# Altium project NoFollowBoard.PrjPcb
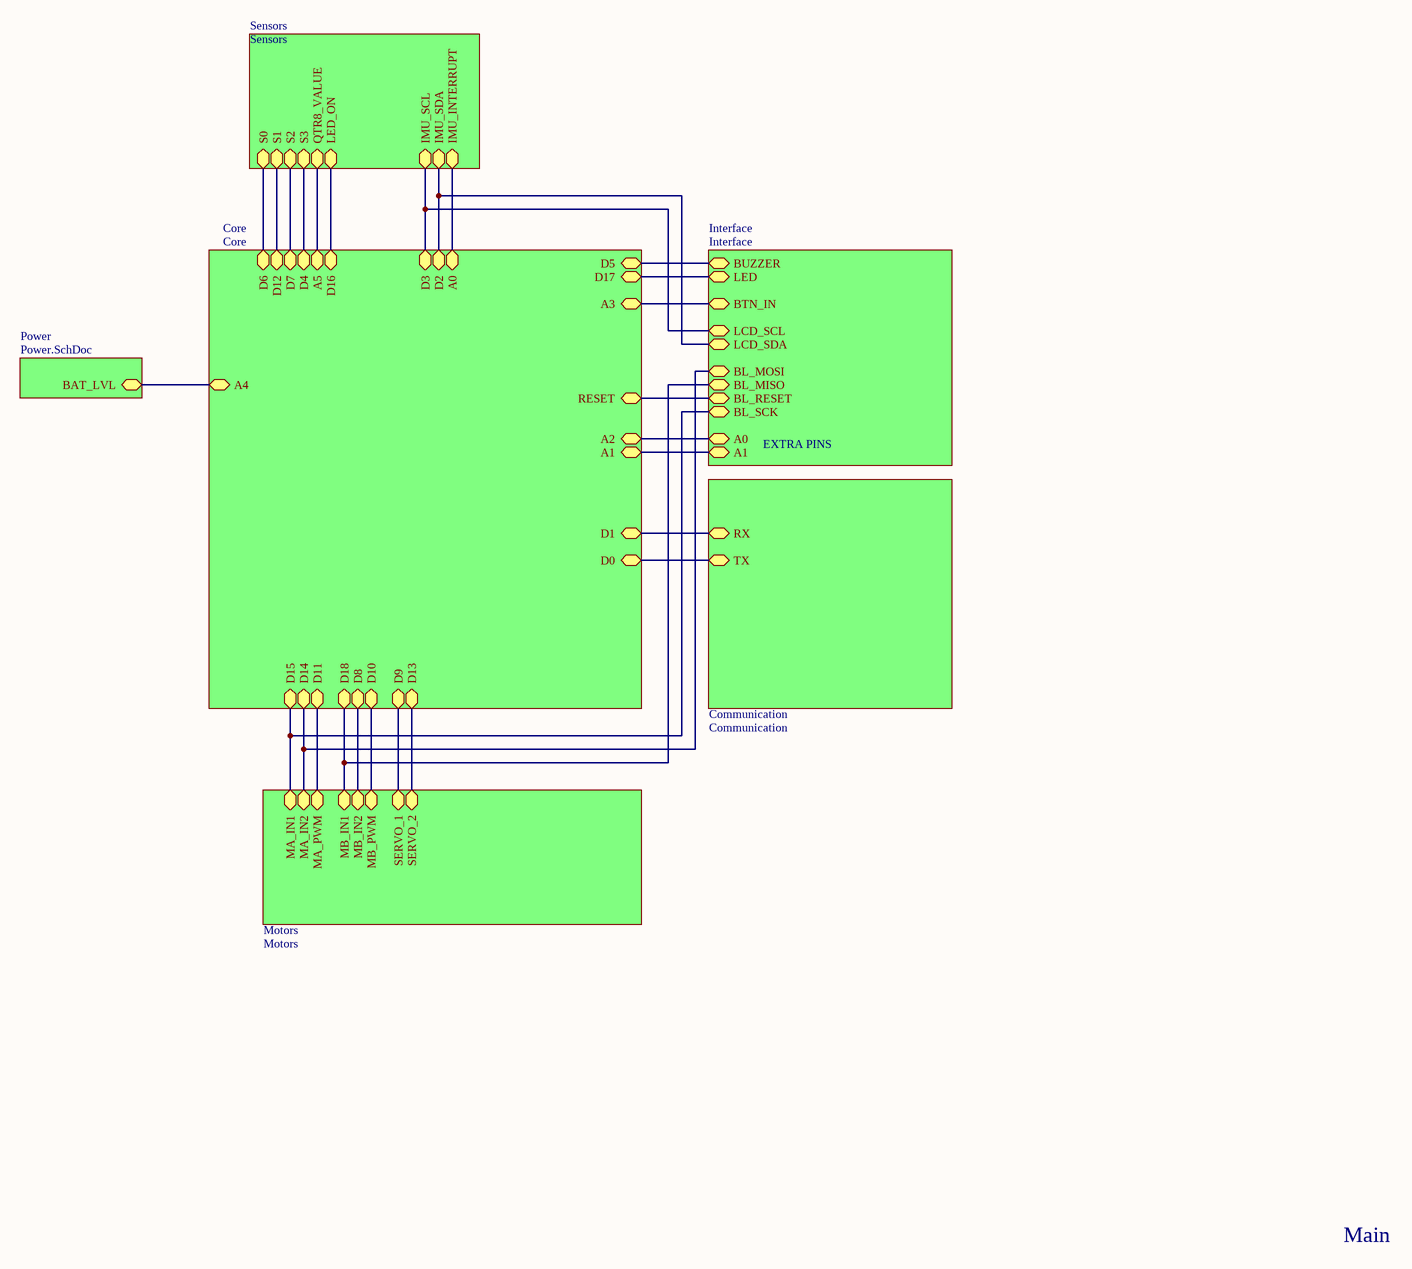
[diagram p0: Main.SchDoc]
4 sheets, 35 parts. Net scope: hierarchical (ports join the sheet entries above them; power ports are global).
Sheets:
  Main.SchDoc
    Sensors = Sensors.SchDoc
    Motors = Motors.SchDoc
    Power = Power.SchDoc

## Sheet Main.SchDoc
size A3

### Sub-sheets
Communication = Communication (file not in this document): RX (bidir), TX (bidir)
Core = Core (file not in this document): D6 (bidir), D12 (bidir), D7 (bidir), D4 (bidir), A5 (bidir), D3 (bidir), D2 (bidir), A0 (bidir), D5 (bidir), D17 (bidir), A3 (bidir), D1 (bidir), D0 (bidir), D8 (bidir), D18 (bidir), D11 (bidir), D14 (bidir), D15 (bidir), D10 (bidir), D9 (bidir), D16, A4, A2, A1, D13, RESET
Interface = Interface (file not in this document): BUZZER (bidir), LED (bidir), BTN_IN (bidir), LCD_SCL (bidir), LCD_SDA (bidir), A0, A1, BL_MOSI, BL_MISO, BL_RESET, BL_SCK
Motors = Motors: MA_IN1 (bidir), MA_IN2 (bidir), MA_PWM (bidir), MB_IN1 (bidir), MB_IN2 (bidir), MB_PWM (bidir), SERVO_1 (bidir), SERVO_2
Power = Power.SchDoc: BAT_LVL
Sensors = Sensors: S0 (bidir), S1 (bidir), S2 (bidir), S3 (bidir), QTR8_VALUE (bidir), IMU_SCL (bidir), IMU_SDA (bidir), IMU_INTERRUPT (bidir), LED_ON

### Nets
NetGY1_3: sheet Core/D3, sheet Sensors/IMU_SCL, sheet Interface/LCD_SCL
NetGY1_4: sheet Core/D2, sheet Sensors/IMU_SDA, sheet Interface/LCD_SDA
NetGY1_8: sheet Core/A0, sheet Sensors/IMU_INTERRUPT
NetJ4_3: sheet Core/D9, sheet Motors/SERVO_1
NetJ5_3: sheet Core/D13, sheet Motors/SERVO_2
NetJ6_9: sheet Core/D16, sheet Sensors/LED_ON
NetMUX1_1: sheet Core/A5, sheet Sensors/QTR8_VALUE
NetMUX1_10: sheet Core/D6, sheet Sensors/S0
NetMUX1_11: sheet Core/D12, sheet Sensors/S1
NetMUX1_13: sheet Core/D4, sheet Sensors/S3
NetMUX1_14: sheet Core/D7, sheet Sensors/S2
NetR11_2: sheet Core/D15, sheet Interface/BL_SCK, sheet Motors/MA_IN1
NetR12_2: sheet Core/D18, sheet Interface/BL_MISO, sheet Motors/MB_IN1
NetR13_2: sheet Core/D8, sheet Motors/MB_IN2
NetR14_2: sheet Core/D14, sheet Interface/BL_MOSI, sheet Motors/MA_IN2
NetR15_1: sheet Core/A4, sheet Power/BAT_LVL
NetU2_8: sheet Core/D11, sheet Motors/MA_PWM
NetU2_14: sheet Core/D10, sheet Motors/MB_PWM
(unnamed): sheet Core/D5, sheet Interface/BUZZER
(unnamed): sheet Core/D17, sheet Interface/LED
(unnamed): sheet Core/A3, sheet Interface/BTN_IN
(unnamed): sheet Core/D1, sheet Communication/RX
(unnamed): sheet Core/D0, sheet Communication/TX
(unnamed): sheet Core/A2, sheet Interface/A0
(unnamed): sheet Core/A1, sheet Interface/A1
(unnamed): sheet Core/RESET, sheet Interface/BL_RESET

### Notes on the sheet
- EXTRA PINS
- Main

## Sheet Sensors.SchDoc
size A3; PageSetup: Record=PageOptions|CenterHorizontal=True|CenterVertical=True|PrintScale=1.00|XCorrection=1.00|YCorrection=1.00|PrintKind=1|BorderSize=5000000|LeftOffset=0|BottomOffset=0|Orientation=2|PaperLength=1000|PaperWidth=1000|Scale=100|PaperSource=7|PrintQuality=-3|MediaType=1|DitherType=10|PrintScaleMode=1|PaperKind=A2|PaperIndex=66
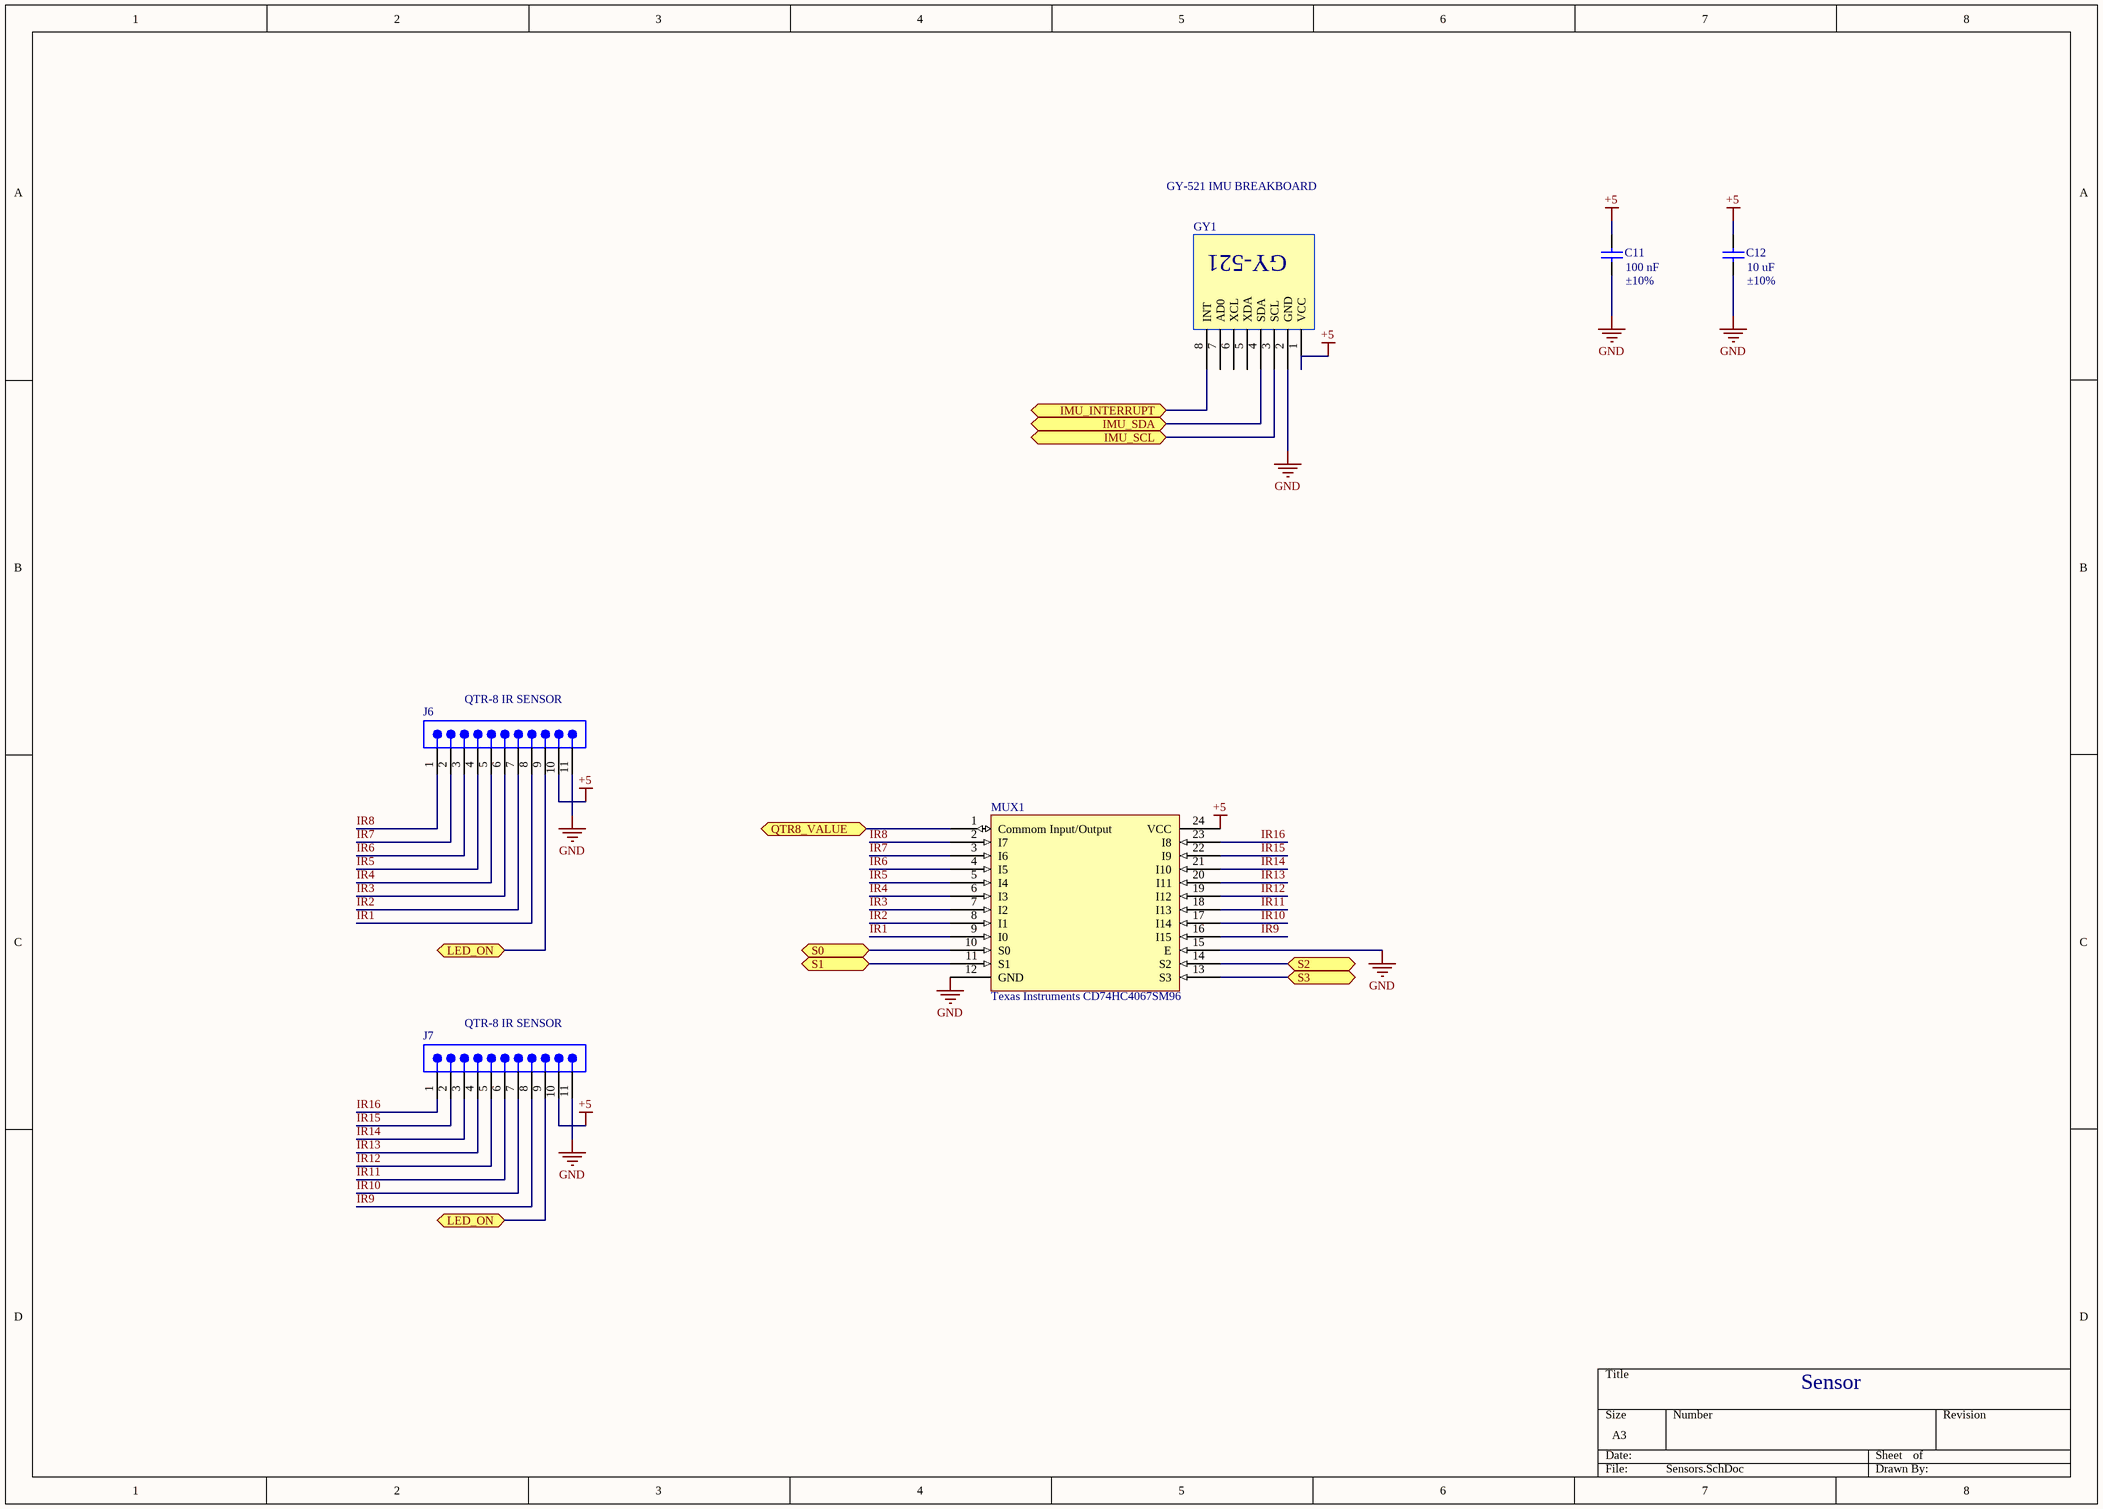
[diagram p1: Sensors.SchDoc]

### Parts
C11  Capacitance: 100 nF  Capacitance Tolerance: ±10%  [PCB-i747o4qnz4fc2aqkwc14-1]  (hidden comment: Taiyo Yuden LMK212BJ106KG-T)
C12  Capacitance: 10 uF  Capacitance Tolerance: ±10%  [PCB-i747o4qnz4fc2aqkwc14-1]  (hidden comment: Taiyo Yuden LMK212BJ106KG-T)
GY1  GY-521 MPU-6050 IMU  [PCBComponent_1]  (value not drawn)
J6  Samtec TSW-111-05-G-S  [1X11]  (value not drawn)
J7  Samtec TSW-111-05-G-S  [1X11]  (value not drawn)
MUX1  Texas Instruments CD74HC4067SM96  [PCBComponent_1]

### Ports
IMU_INTERRUPT (bidir), IMU_SCL (bidir), IMU_SDA (bidir), LED_ON (bidir), QTR8_VALUE (bidir), S0 (bidir), S1 (bidir), S2 (bidir), S3 (bidir)

### Nets
+5: C11.2 C12.2 GY1.1(VCC) J6.10 J7.10 MUX1.24(VCC)
GND: C11.1 C12.1 GY1.2(GND) J6.11 J7.11 MUX1.12(GND) MUX1.15(E)
IR1: J6.8 MUX1.9(I0)
IR2: J6.7 MUX1.8(I1)
IR3: J6.6 MUX1.7(I2)
IR4: J6.5 MUX1.6(I3)
IR5: J6.4 MUX1.5(I4)
IR6: J6.3 MUX1.4(I5)
IR7: J6.2 MUX1.3(I6)
IR8: J6.1 MUX1.2(I7)
IR9: J7.8 MUX1.16(I15)
IR10: J7.7 MUX1.17(I14)
IR11: J7.6 MUX1.18(I13)
IR12: J7.5 MUX1.19(I12)
IR13: J7.4 MUX1.20(I11)
IR14: J7.3 MUX1.21(I10)
IR15: J7.2 MUX1.22(I9)
IR16: J7.1 MUX1.23(I8)
NetGY1_3: GY1.3(SCL) ; port IMU_SCL
NetGY1_4: GY1.4(SDA) ; port IMU_SDA
NetGY1_8: GY1.8(INT) ; port IMU_INTERRUPT
NetJ6_9: J6.9 J7.9 ; port LED_ON
NetMUX1_1: MUX1.1(Commom_Input/Output) ; port QTR8_VALUE
NetMUX1_10: MUX1.10(S0) ; port S0
NetMUX1_11: MUX1.11(S1) ; port S1
NetMUX1_13: MUX1.13(S3) ; port S3
NetMUX1_14: MUX1.14(S2) ; port S2

Not connected (* = marked no-connect by the designer): GY1 5(XDA) 6(XCL) 7(AD0)

### Notes on the sheet
- GY-521 IMU BREAKBOARD
- (near J6) QTR-8 IR SENSOR
- (near J7) QTR-8 IR SENSOR
- Sensor
- (in symbol CMP-1172158-5) GY-521

### Library data of the parts
C11 C12 = CMP-6ecba7c24c09b10c-2: Cap Ceramic 10uF 10V X5R 10% SMD 0805 85?C T/R; Lead-Free Status: Lead Free; Voltage Rating (DC): 10.0 V; Case/Package (SI): 2012; Mounting Style: Surface Mount; Manufacturer Part Number: LMK212BJ106KG-T; Packaging: Cut Tape (CT); RoHS: Compliant; Number of Pins: 2; Lifecycle Status: Not Listed by Manufacturer; OctopartID: 6ecba7c24c09b10c; Size-Length: 0.002 m; Size-Height: 0.00125 m; Dielectric Characteristic: X5R; Octopart URL: http://octopart.com/lmk212bj106kg-t-taiyo+yuden-198564; Size-Width: 0.00125 m; Case/Package: 0805
GY1 = CMP-1172158-5: 3-axis gyroscope, 3-axis accelerometer breakout board; Supply Voltage (DC): 5v; Packaging: Cut Tape (CT); REACH SVHC Compliance: No SVHC; Number of Pins: 8; Octopart URL: http://octopart.com/mpu-6050-invensense-19505926; OctopartID: 29a8e18bafc8f66f; RoHS: Compliant; Manufacturer Part Number: MPU-6050
J6 J7 = CMP-3970764-2: CONN HEADER 11POS .100" SGL GOLD; Gender: Male; Lead-Free Status: Lead Free; Number of Contacts: 11; Pin Pitch: 0.00254 m; Contact Material: Phosphor Bronze; Contact Plating: Gold; Housing Color: Black; Housing Material: Plastic; Mounting Style: Through Hole; Number of Positions: 11; Number of Rows: 1; Octopart Url: https://octopart.com/tsw-111-05-g-s-samtec-271406; OctopartID: 84944d9a85dc5b53; REACH SVHC Compliance: No SVHC; RoHS: Compliant; Size-Height: 0.00254 m; Size-Length: 0.02794 m; Size-Width: 0.00254 m
MUX1 = CMP-106ed96303d9cfa9-2: High Speed CMOS 16-Channel Analog Multiplexer/Demultiplexer 24-SSOP -55 to 125; Supply Voltage (DC): 2.00 V (min); Number of Bits: 16; Lead-Free Status: Lead Free; Number of Circuits: 1; Polarity: Non-Inverting; Mounting Style: Surface Mount; OctopartID: 106ed96303d9cfa9; Case/Package: SSOP; Number of Outputs: 16; Number of Channels: 16; RoHS: Compliant; Number of Pins: 24; Lifecycle Status: Active; REACH SVHC Compliance: No SVHC; Packaging: Tape & Reel (TR), Cut Tape (CT); Octopart URL: http://octopart.com/cd74hc4067sm96-texas+instruments-472785; Manufacturer Part Number: CD74HC4067SM96

## Sheet Motors.SchDoc
size A
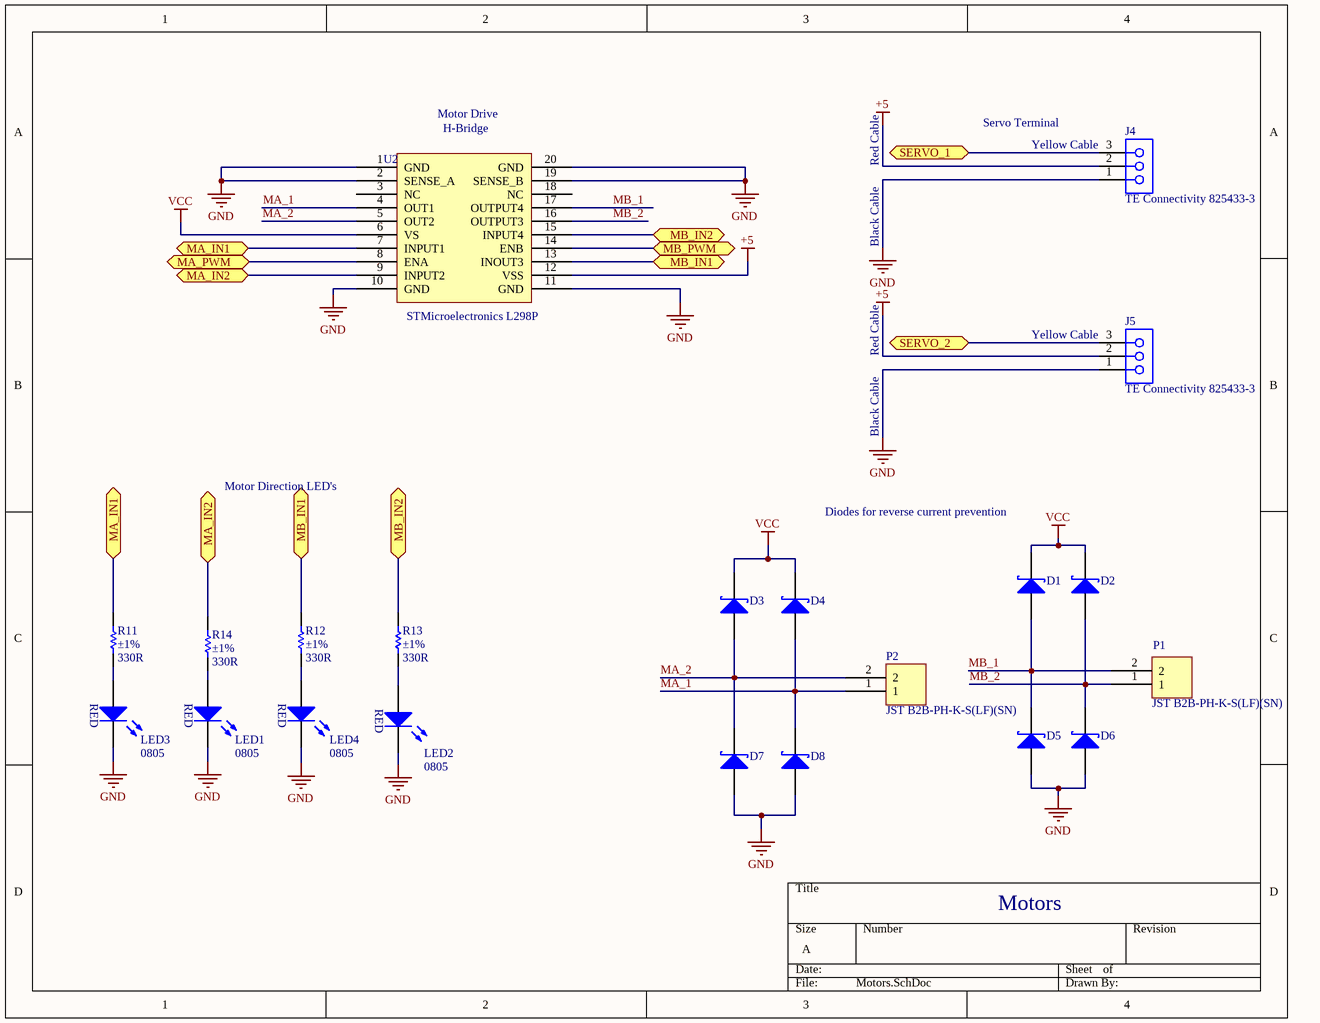
[diagram p2: Motors.SchDoc]

### Parts
D1  SS34 SMA DO-214AC  [SMA]  (value not drawn)
D2  SS34 SMA DO-214AC  [SMA]  (value not drawn)
D3  SS34 SMA DO-214AC  [SMA]  (value not drawn)
D4  SS34 SMA DO-214AC  [SMA]  (value not drawn)
D5  SS34 SMA DO-214AC  [SMA]  (value not drawn)
D6  SS34 SMA DO-214AC  [SMA]  (value not drawn)
D7  SS34 SMA DO-214AC  [SMA]  (value not drawn)
D8  SS34 SMA DO-214AC  [SMA]  (value not drawn)
J4  TE Connectivity 825433-3  [PCB-43x6b8o6d5mxbq35c0sh-1]
J5  TE Connectivity 825433-3  [PCB-43x6b8o6d5mxbq35c0sh-1]
LED1  Case/Package: 0805  [LED0805]  (hidden comment: CMP-7f15b6173d91a0d2-5)
LED2  Case/Package: 0805  [LED0805]  (hidden comment: CMP-7f15b6173d91a0d2-5)
LED3  Case/Package: 0805  [LED0805]  (hidden comment: CMP-7f15b6173d91a0d2-5)
LED4  Case/Package: 0805  [LED0805]  (hidden comment: CMP-7f15b6173d91a0d2-5)
P1  JST B2B-PH-K-S(LF)(SN)  [PCB-gpdi66yn1jko56crxrq7-1]
P2  JST B2B-PH-K-S(LF)(SN)  [PCB-gpdi66yn1jko56crxrq7-1]
R11  Resistance Tolerance: ±1%  Resistance: 330R  [PCB-4097432-1]  (hidden comment: Bourns CR0805-FX-4701GLF)
R12  Resistance Tolerance: ±1%  Resistance: 330R  [PCB-4097432-1]  (hidden comment: Bourns CR0805-FX-4701GLF)
R13  Resistance Tolerance: ±1%  Resistance: 330R  [PCB-4097432-1]  (hidden comment: Bourns CR0805-FX-4701GLF)
R14  Resistance Tolerance: ±1%  Resistance: 330R  [PCB-4097432-1]  (hidden comment: Bourns CR0805-FX-4701GLF)
U2  STMicroelectronics L298P  [L298PSOIC127P1420X360-20N]

### Ports
MA_IN1 (bidir), MA_IN2 (bidir), MA_PWM (bidir), MB_IN1 (bidir), MB_IN2 (bidir), MB_PWM (bidir), SERVO_1 (bidir), SERVO_2 (bidir)

### Nets
+5: J4.2 J5.2 U2.12(VSS)
GND: D5.1(A) D6.1(A) D7.1(A) D8.1(A) J4.1 J5.1 LED1.1(K) LED2.1(K) LED3.1(K) LED4.1(K) U2.1(GND) U2.2(SENSE_A) U2.10(GND) U2.11(GND) U2.19(SENSE_B) U2.20(GND)
VCC: D1.2(K) D2.2(K) D3.2(K) D4.2(K) U2.6(VS)
MA_1: D4.1(A) D8.2(K) P2.1 U2.4(OUT1)
MA_2: D3.1(A) D7.2(K) P2.2 U2.5(OUT2)
MB_1: D1.1(A) D5.2(K) P1.2 U2.17(OUTPUT4)
MB_2: D2.1(A) D6.2(K) P1.1 U2.16(OUTPUT3)
NetJ4_3: J4.3 ; port SERVO_1
NetJ5_3: J5.3 ; port SERVO_2
NetLED1_2: LED1.2(A) R14.1
NetLED2_2: LED2.2(A) R13.1
NetLED3_2: LED3.2(A) R11.1
NetLED4_2: LED4.2(A) R12.1
NetR11_2: R11.2 U2.7(INPUT1) ; port MA_IN1
NetR12_2: R12.2 U2.13(INOUT3) ; port MB_IN1
NetR13_2: R13.2 U2.15(INPUT4) ; port MB_IN2
NetR14_2: R14.2 U2.9(INPUT2) ; port MA_IN2
NetU2_8: U2.8(ENA) ; port MA_PWM
NetU2_14: U2.14(ENB) ; port MB_PWM

Not connected (* = marked no-connect by the designer): U2 3(NC) 18(NC)

### Notes on the sheet
- (near U2) Motor Drive
- (near U2) H-Bridge
- Red Cable
- Servo Terminal
- (near J4) Yellow Cable
- Black Cable
- (near J5) Yellow Cable
- Motor Direction LED's
- Diodes for reverse current prevention
- Motors
- (in symbol CMP-7f15b6173d91a0d2-5) RED

### Library data of the parts
D1-D8 = CMP-cx3sevj7k2ks0umzedmk-1: A Schotty Barrier Rectifier; CustomComponentID: cx3sevj7k2ks0umzedmk
J4 J5 = CMP-52d299a8d8748d15-5: Pin header; pin strips; AMPMODU MOD II; male; PIN: 3; straight; ELV Compliant: Compliant; Pin Pitch: 0.00254 m; Number of Contacts: 3; Current Rating: 3.0 A; Housing Color: Green; OctopartID: 52d299a8d8748d15; REACH SVHC Compliance: No SVHC; Flammability Rating: UL 94 V-0; Orientation: Vertical; Lifecycle Status: Active; Octopart URL: http://octopart.com/825433-3-te+connectivity-40939456; Housing Material: Polyester; Packaging: Box; Contact Plating: Gold, Gold over Nickel, Tin, Tin over Nickel; Gender: Male; Manufacturer Part Number: 825433-3; Mounting Style: PCB; Contact Material: Brass; RoHS: Compliant
LED1-LED4 = CMP-7f15b6173d91a0d2-5: LED; SMD; 0805; red; 7.2-17mcd; 2x1.25mm; 170°; 1.8÷2.6V; 20mA; Manufacturer Part Number: HSMH-C170; Lead-Free Status: Lead Free; Lens Type: Diffused; Power Dissipation: 0.065 W; Voltage Rating (DC): 1.8 V; Luminous Intensity: 0.017 cd; Lens Color: Clear; Peak Wavelength: 6.6e-07 m; Wavelength: 6.39e-07 m; Case/Package (SI): 2012; RoHS: Compliant; Number of Pins: 2; Forward Voltage: 1.8 V; Packaging: Cut Tape (CT); Viewing Angle: 170 °; Octopart URL: http://octopart.com/hsmh-c170-avago-550882; REACH SVHC Compliance: No SVHC; Order Code (RS Components): 486-0468; Color: Red; OctopartID: 7f15b6173d91a0d2; Lifecycle Status: Active; Mounting Style: Surface Mount, Vertical; Part Description: *
P1 P2 = CMP-642947-5: PH Series 2 Position 2 mm Pitch Through Hole Top Entry Shrouded Header; Number of Positions: 2; Pin Pitch: 2.00 mm; Current Rating: 2.00 A; Insulation Resistance: 1.00 MΩ; Gender: Male; Lead-Free Status: Lead Free; Voltage Rating (AC): 100 V; Contact Resistance: 10.0 mΩ; Packaging: Bulk; RoHS: Compliant; REACH SVHC Compliance: No SVHC; Size-Length: 5.90 mm; OctopartID: a21c6b154b5e7ddb; Octopart URL: http://octopart.com/b2b-ph-k-s%28lf%29%28sn%29-jst-248868; Size-Height: 6.00 mm; Housing Material: Nylon; Size-Width: 4.50 mm; Mounting Style: Through Hole, Vertical; Manufacturer Part Number: B2B-PH-K-S(LF)(SN); Number of Rows: 1; Contact Material: Brass; Housing Color: Natural; Number of Contacts: 2; Contact Plating: Tin
R11-R14 = CMP-97505e06006c4897-1: Res Thick Film 0805 4.7K Ohm 1% 1/8W ±100ppm/°C Molded SMD SMD Paper Tape on Plastic Reel; Voltage Rating (DC): 150 V; Power Rating: 125 mW; Manufacturer Part Number: CR0805-FX-4701GLF; REACH SVHC Compliance: No SVHC; OctopartID: 97505e06006c4897; Packaging: Tape & Reel (TR), Cut Tape (CT); Octopart URL: http://octopart.com/cr0805-fx-4701glf-bourns-6074970; Number of Pins: 2; Mounting Style: Surface Mount; RoHS: Compliant; Size-Thickness: 508 µm; Size-Length: 2.01 mm; Case/Package: 0805; Size-Width: 1.24 mm
U2 = CMP-1433026-9: L298 Series Dual Full Bridge 4 A 46 V Driver Surface Mount - PowerSO-20; Lead-Free Status: Lead Free; Supply Voltage (DC): 46.0 V (max); Number of Channels: 2; Manufacturer Part Number: L298P; Mounting Style: Surface Mount; Octopart URL: http://octopart.com/l298p-stmicroelectronics-468197; Packaging: Tube; RoHS: Compliant; Lifecycle Status: Active; OctopartID: b6bd7fb0b73e697a

## Sheet Power.SchDoc
size A
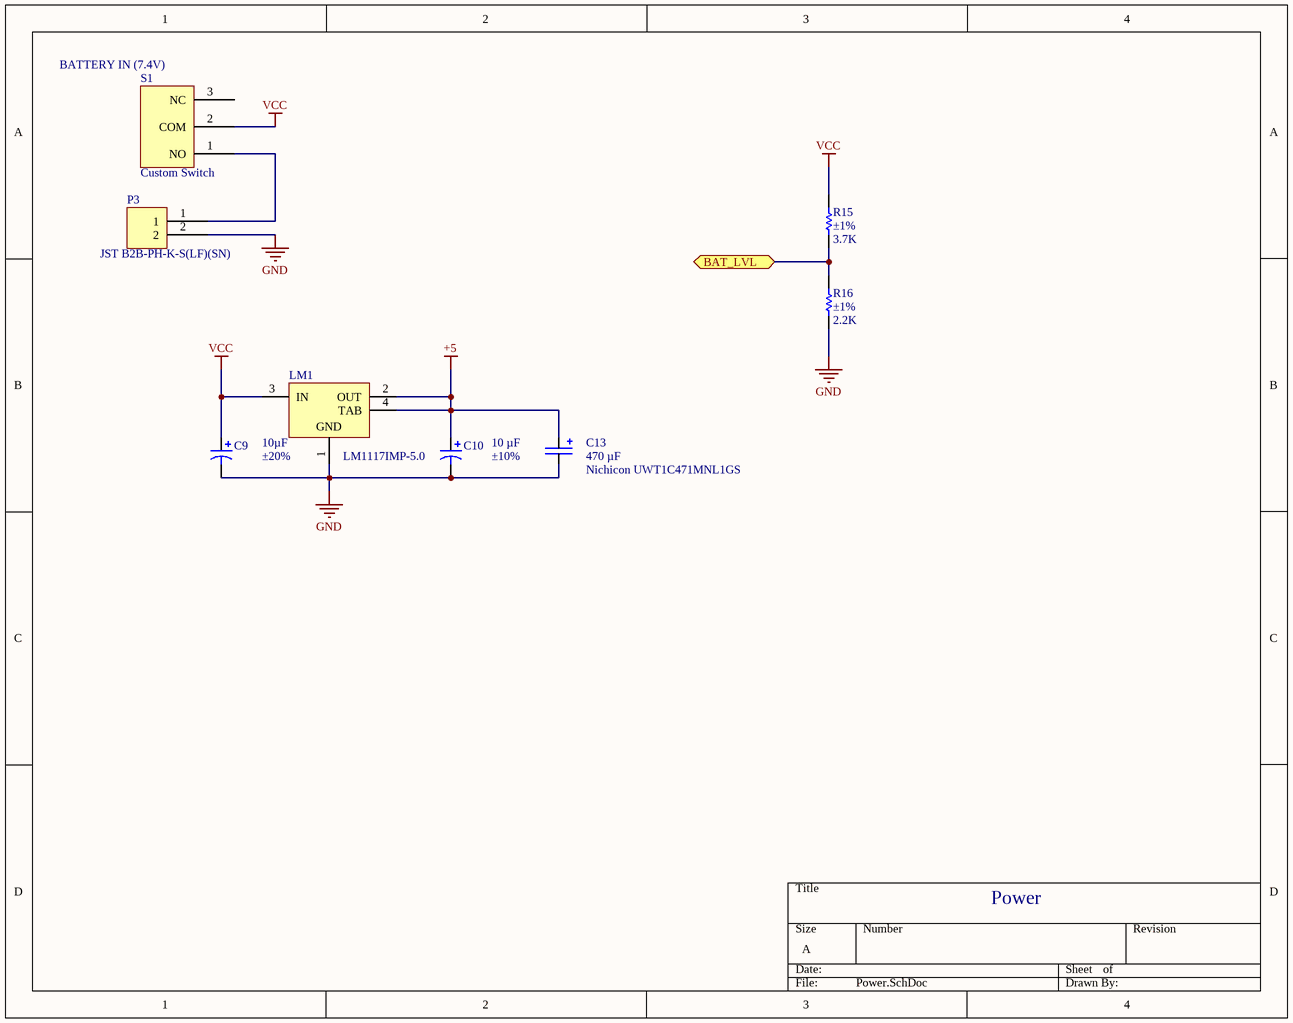
[diagram p3: Power.SchDoc]

### Parts
C9  Capacitance: 10µF  Capacitance Tolerance: ±20%  [PCB-220579-1]  (hidden comment: Kemet T491A106M006AT)
C10  Capacitance: 10 µF  Capacitance Tolerance: ±10%  [CASE B]  (hidden comment: Kemet T491B476K010AT)
C13  Nichicon UWT1C471MNL1GS  Capacitance: 470 µF  [PCB-ohlypd69c1s53jj2mkj6-1]
LM1  LM1117IMP-5.0  [MP04A_L]
P3  JST B2B-PH-K-S(LF)(SN)  [PCB-gpdi66yn1jko56crxrq7-1]
R15  Resistance Tolerance: ±1%  Resistance: 3.7K  [PCB-4097432-1]  (hidden comment: Bourns CR0805-FX-4701GLF)
R16  Resistance Tolerance: ±1%  Resistance: 2.2K  [PCB-4097432-1]  (hidden comment: Bourns CR0805-FX-4701GLF)
S1  Custom Switch  [PCB-tnt45azynpcpxvd4cmrw-1]

### Ports
BAT_LVL (bidir)

### Nets
+5: C10.1 C13.P(+) LM1.2(OUT) LM1.4(TAB)
GND: C9.2 C10.2 C13.M(-) LM1.1(GND) P3.2 R16.1
VCC: C9.1 LM1.3(IN) R15.2 S1.2(COM)
NetP3_1: P3.1 S1.1(NO)
NetR15_1: R15.1 R16.2 ; port BAT_LVL

Not connected (* = marked no-connect by the designer): S1 3(NC)

### Notes on the sheet
- (near S1) BATTERY IN (7.4V)
- Power

### Library data of the parts
C9 = CMP-220579-2: CAP TANT 10UF 6.3V 20% 1206; Case/Package (SI): 3216-18; Equivalent Series Resistance (ESR): 4.0 Ω; Lead-Free Status: Lead Free; Voltage Rating (DC): 6.0 V; Case/Package: 3216-18; Mounting Style: Surface Mount; Number of Pins: 2; Octopart Url: https://octopart.com/t491a106m006at-kemet-219770; OctopartID: 6a85a38c1599b542; Packaging: Cut Tape (CT); REACH SVHC Compliance: No SVHC; RoHS: Compliant; Size-Height: 0.0016 m; Size-Length: 0.0032 m; Size-Width: 0.0016 m
C10 = CMP-14388383-6: Cap Tant Solid 47uF 10V B CASE 10% (3.5 X 2.8 X 1.9mm) SMD 3528-21 1 Ohm 125C Automotive T/R; Dielectric Material: Tantalum; Voltage Rating (DC): 10.0 V; Lead-Free Status: Lead Free; Equivalent Series Resistance (ESR): 1.00 Ω; Case/Package (SI): 3528-21; REACH SVHC Compliance: No SVHC; Size-Height: 1.90 mm; Size-Width: 2.80 mm; RoHS: Compliant; OctopartID: e2462b4200883d81; Packaging: Tape & Reel (TR), Cut Tape (CT); Mounting Style: Surface Mount; Case/Package: 3528-21; Manufacturer Part Number: T491B476K010AT; Octopart URL: http://octopart.com/t491b476k010at-kemet-968616; Number of Pins: 2; Size-Length: 3.50 mm
C13 = CMP-f01f3916cccd2fd8-3: 8mm x 10mm 105deg Rohs=Yes 470uf 16-Volt Surface Mtg/Pkg Aluminum Electrolytic Cap; Capacitance Tolerance: ±20%; Voltage Rating (DC): 16.0 V; Lead-Free Status: Lead Free; Octopart URL: http://octopart.com/uwt1c471mnl1gs-nichicon-203188; Dielectric Material: Aluminum Electrolytic; Size-Height: 10.0 mm; REACH SVHC Compliance: No SVHC; Packaging: Cut Tape (CT), Tape & Reel (TR); Size-Diameter: 8.00 mm; Mounting Style: Surface Mount; Manufacturer Part Number: UWT1C471MNL1GS; OctopartID: f01f3916cccd2fd8; Size-Length: 10.0 mm; RoHS: Compliant; Number of Pins: 2
LM1 = LM1117IMP-5.0/NOPB: 800mA Low-Dropout Linear Regulator, 4-pin SOT-223, Pb-Free; Current Rating: 800.0 A; Dropout Voltage: 1.2 V; Lead-Free Status: Lead Free; Number of Regulated Outputs: 1; Output Capacitor Type: Tantalum; Output Current: 0.8 A; Output Voltage: 5.0 V; Quiescent Current: 0.005 A; Supply Voltage (DC): 15.0 V; Case/Package: SOT-223; Lifecycle Status: Active; Mounting Style: Surface Mount; Number of Pins: 4; Octopart Url: https://octopart.com/lm1117imp-5.0%2Fnopb-texas+instruments-22615740; OctopartID: fae932bac933252e; REACH SVHC Compliance: No SVHC; RoHS: Compliant
P3 = CMP-642947-5: as P1 on sheet Motors; Packaging: Bulk; RoHS: Compliant; REACH SVHC Compliance: No SVHC; Size-Length: 5.90 mm; OctopartID: a21c6b154b5e7ddb; Octopart URL: http://octopart.com/b2b-ph-k-s%28lf%29%28sn%29-jst-248868; Size-Height: 6.00 mm; Housing Material: Nylon; Size-Width: 4.50 mm; Mounting Style: Through Hole, Vertical; Manufacturer Part Number: B2B-PH-K-S(LF)(SN); Number of Rows: 1; Contact Material: Brass; Housing Color: Natural; Number of Contacts: 2; Contact Plating: Tin
R15 R16 = CMP-97505e06006c4897-1: as R11 on sheet Motors; Manufacturer Part Number: CR0805-FX-4701GLF; REACH SVHC Compliance: No SVHC; OctopartID: 97505e06006c4897; Packaging: Tape & Reel (TR), Cut Tape (CT); Octopart URL: http://octopart.com/cr0805-fx-4701glf-bourns-6074970; Number of Pins: 2; Mounting Style: Surface Mount; RoHS: Compliant; Size-Thickness: 508 µm; Size-Length: 2.01 mm; Case/Package: 0805; Size-Width: 1.24 mm
S1 = Custom Switch-2: Switch Used in 2015's very small size robot; CustomComponentID: s1vauaimn8qz55onjbfq

## Nets that join several sheets
+5: Sensors (6 pins), Motors (J4.2 J5.2 U2.12), Power (C10.1 C13.P LM1.2 LM1.4)
GND: Sensors (7 pins), Motors (16 pins), Power (6 pins)
VCC: Motors (5 pins), Power (C9.1 LM1.3 R15.2 S1.2)